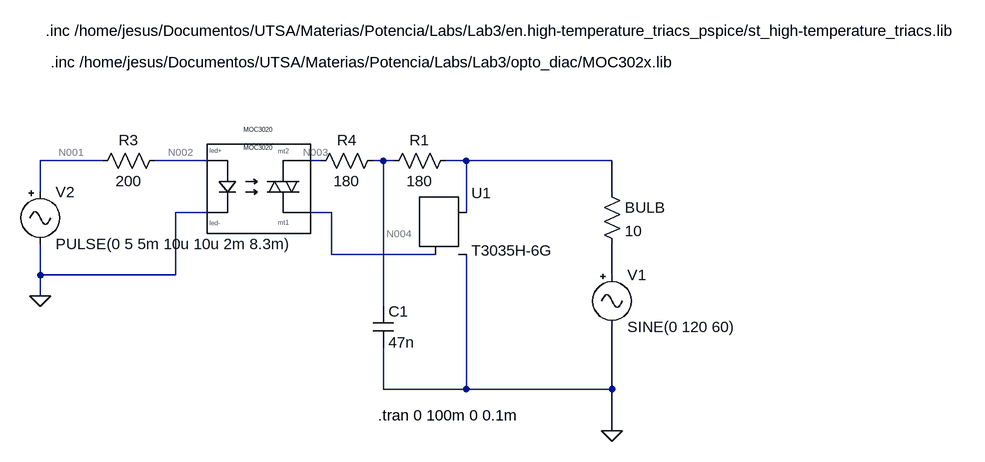
[diagram p0: schematic AC_AC_Converter.asc]
AC_AC_Converter.asc, the LTspice schematic file:
Version 4
SHEET 1 1348 680
WIRE -320 -192 -416 -192
WIRE -160 -192 -240 -192
WIRE 16 -192 0 -192
WIRE 112 -192 96 -192
WIRE 128 -192 112 -192
WIRE 240 -192 208 -192
WIRE 464 -192 240 -192
WIRE -416 -144 -416 -192
WIRE 464 -144 464 -192
WIRE -160 -112 -208 -112
WIRE 32 -112 0 -112
WIRE 240 -112 240 -192
WIRE 32 -48 32 -112
WIRE 192 -48 32 -48
WIRE -416 -16 -416 -64
WIRE -208 -16 -208 -112
WIRE -208 -16 -416 -16
WIRE 464 -16 464 -64
WIRE -416 16 -416 -16
WIRE 112 32 112 -192
WIRE 112 160 112 96
WIRE 240 160 240 -48
WIRE 240 160 112 160
WIRE 464 160 464 64
WIRE 464 160 240 160
WIRE 464 224 464 160
FLAG -416 16 0
FLAG 464 224 0
SYMBOL Misc\\signal 464 -32 R0
WINDOW 123 0 0 Left 0
WINDOW 39 0 0 Left 0
SYMATTR InstName V1
SYMATTR Value SINE(0 120 60)
SYMBOL res 448 -160 R0
SYMATTR InstName BULB
SYMATTR Value 10
SYMBOL Optos\\LED_TRIAC -112 -176 R0
WINDOW 38 32 112 Invisible 0
WINDOW 3 32 -36 Center 0
SYMATTR SpiceModel ""
SYMATTR Value MOC3020
SYMATTR InstName MOC3020
SYMBOL Misc\\TRIAC 208 -112 R0
SYMATTR InstName U1
SYMATTR Value T3035H-6G
SYMBOL res 224 -208 R90
WINDOW 0 0 56 VBottom 2
WINDOW 3 32 56 VTop 2
SYMATTR InstName R1
SYMATTR Value 180
SYMBOL Misc\\signal -416 -160 R0
WINDOW 123 0 0 Left 0
WINDOW 39 0 0 Left 0
SYMATTR InstName V2
SYMATTR Value PULSE(0 5 5m 10u 10u 2m 8.3m)
SYMBOL res -224 -208 R90
WINDOW 0 0 56 VBottom 2
WINDOW 3 32 56 VTop 2
SYMATTR InstName R3
SYMATTR Value 200
SYMBOL res 112 -208 R90
WINDOW 0 0 56 VBottom 2
WINDOW 3 32 56 VTop 2
SYMATTR InstName R4
SYMATTR Value 180
SYMBOL cap 96 32 R0
SYMATTR InstName C1
SYMATTR Value 47n
TEXT 104 200 Left 2 !.tran 0 100m 0 0.1m
TEXT -408 -392 Left 2 !.inc /home/jesus/Documentos/UTSA/Materias/Potencia/Labs/Lab3/en.high-temperature_triacs_pspice/st_high-temperature_triacs.lib
TEXT -400 -344 Left 2 !.inc /home/jesus/Documentos/UTSA/Materias/Potencia/Labs/Lab3/opto_diac/MOC302x.lib

The netlist it stands for:
* AC_AC_Converter.asc
V1 N007 0 SINE(0 120 60)
R§BULB N005 N007 10
XMOC3020 N002 0 N003 N006 MOC3020  ; pins led+ led- mt2 mt1
XU1 N005 N006 0 T3035H-6G  ; pins MT2 G MT1
R1 N005 N004 180
V2 N001 0 PULSE(0 5 5m 10u 10u 2m 8.3m)
R3 N002 N001 200
R4 N004 N003 180
C1 N004 0 47n
.tran 0 100m 0 0.1m
.inc /home/jesus/Documentos/UTSA/Materias/Potencia/Labs/Lab3/en.high-temperature_triacs_pspice/st_high-temperature_triacs.lib
.inc /home/jesus/Documentos/UTSA/Materias/Potencia/Labs/Lab3/opto_diac/MOC302x.lib
.backanno
.end

* Results of the author's LTspice run, read from the files saved beside the schematic
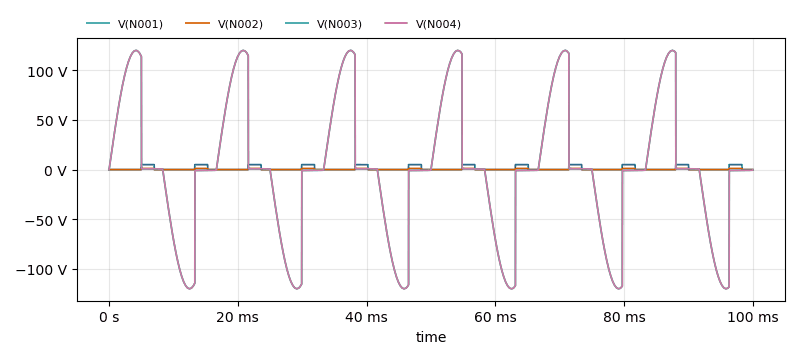
[diagram p1: Transient Analysis of AC_AC_Converter.asc, plotted from the saved traces]
* Transient Analysis, 1 run:
*   V(N001): min 0 V, max 5 V, average 1.206 V, rms 2.454 V, last 0 V
*   V(N002): min 0 V, max 1.184 V, average 286.5 mV, rms 582.3 mV, last 0 V
*   V(N003): min -120 V, max 120 V, average 230.1 mV, rms 68.69 V, last -310 mV
*   V(N004): min -120 V, max 120 V, average 230 mV, rms 68.72 V, last -309.9 mV